# Altium schematic sheet FrontEndCircuit.SchDoc
size A3
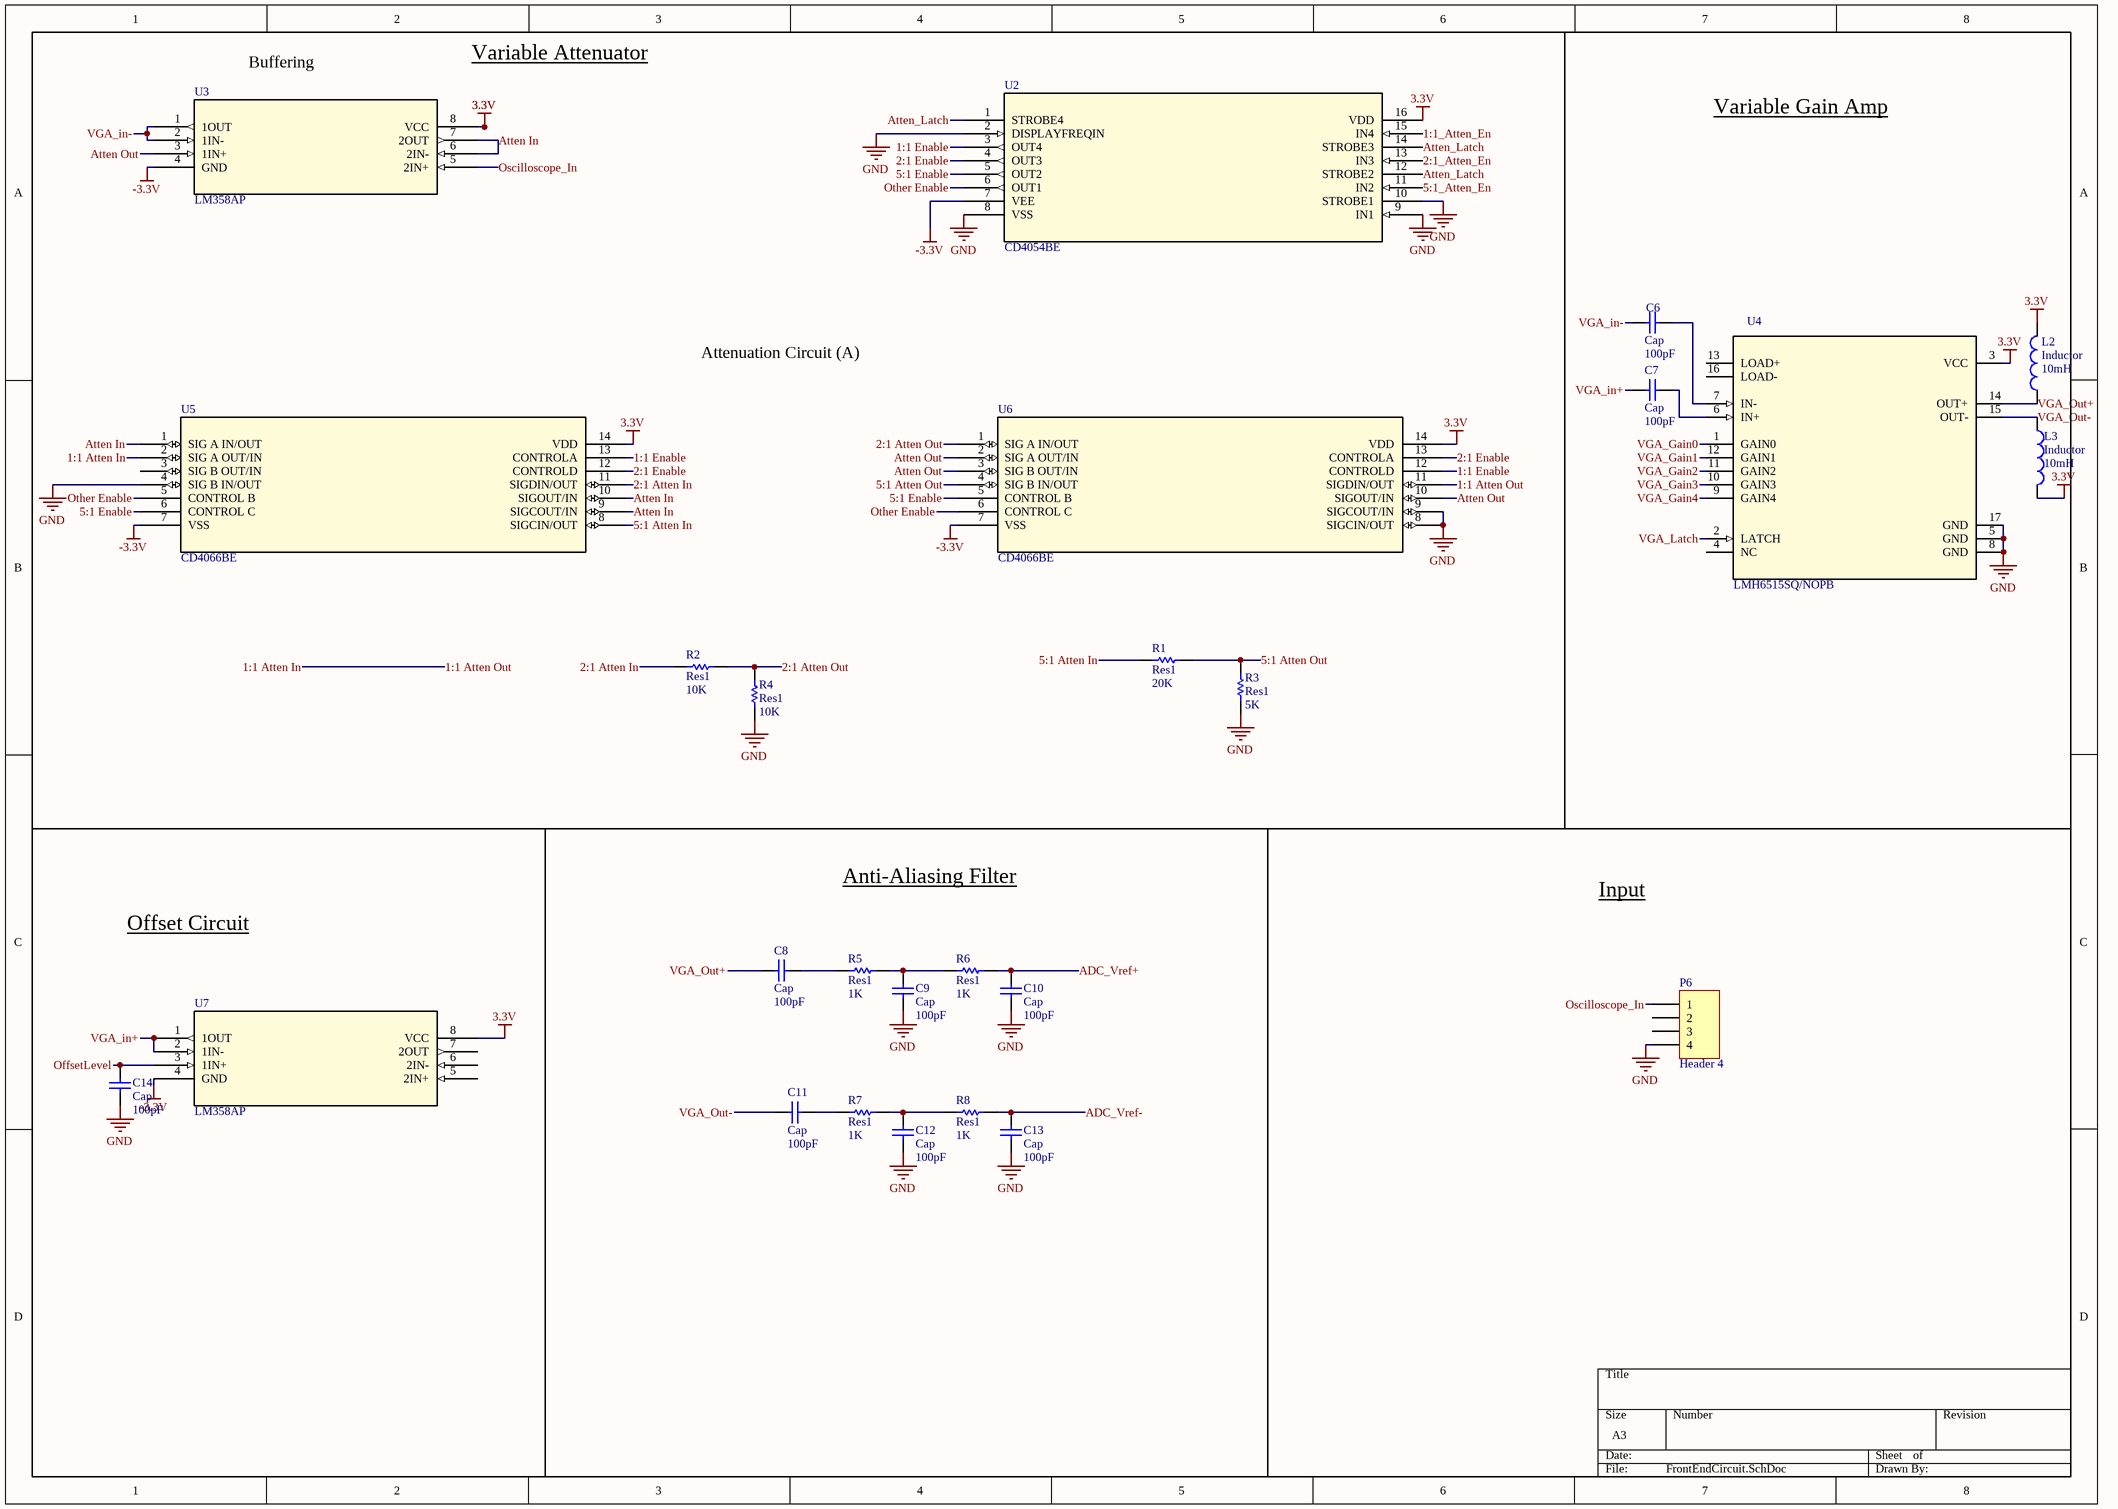
[diagram p0: FrontEndCircuit.SchDoc]

## Parts
C6  Cap  value 100pF  [6-0805_N]
C7  Cap  value 100pF  [6-0805_N]
C8  Cap  value 100pF  [6-0805_N]
C9  Cap  value 100pF  [6-0805_N]
C10  Cap  value 100pF  [6-0805_N]
C11  Cap  value 100pF  [6-0805_N]
C12  Cap  value 100pF  [6-0805_N]
C13  Cap  value 100pF  [6-0805_N]
C14  Cap  value 100pF  [6-0805_N]
L2  Inductor  value 10mH  [6-0805_N]
L3  Inductor  value 10mH  [6-0805_N]
P6  Header 4  [HDR1X4]
R1  Res1  value 20K  [AXIAL-0.3]
R2  Res1  value 10K  [AXIAL-0.3]
R3  Res1  value 5K  [AXIAL-0.3]
R4  Res1  value 10K  [AXIAL-0.3]
R5  Res1  value 1K  [AXIAL-0.3]
R6  Res1  value 1K  [AXIAL-0.3]
R7  Res1  value 1K  [AXIAL-0.3]
R8  Res1  value 1K  [AXIAL-0.3]
U2  CD4054BE  [N16]
U3  LM358AP  [P8]
U4  LMH6515SQ/NOPB  [SQA16A]
U5  CD4066BE  [N14]
U6  CD4066BE  [N14]
U7  LM358AP  [P8]

## Blocks framed on the sheet
Variable Attenuator: R1-R4 U2 U3 U5 U6
Variable Gain Amp: C6 C7 L2 L3 U4
Offset Circuit: C14 U7
Anti-Aliasing Filter: C8-C13 R5-R8
Input: P6

## Nets
3.3V: L2.2 L3.2 U2.16(VDD) U3.8(VCC) U4.3(VCC) U5.14(VDD) U6.14(VDD) U7.8(VCC)
-3.3V: U2.7(VEE) U3.4(GND) U5.7(VSS) U6.7(VSS) U7.4(GND)
GND: C9.1 C10.1 C12.1 C13.1 C14.1 P6.4 R3.1 R4.1 U2.2(DISPLAYFREQIN) U2.8(VSS) U2.9(IN1) U2.10(STROBE1) U4.5(GND) U4.8(GND) U4.17(GND) U5.4(SIG_B_IN/OUT) U6.8(SIGCIN/OUT) U6.9(SIGCOUT/IN)
1:1 Atten In: U5.2(SIG_A_OUT/IN) U6.11(SIGDIN/OUT)  [also labelled 1:1 Atten Out]
1:1 Enable: U2.3(OUT4) U5.13(CONTROLA) U6.12(CONTROLD)
1:1_Atten_En: U2.15(IN4)
2:1 Atten In: R2.1 U5.11(SIGDIN/OUT)
2:1 Atten Out: R2.2 R4.2 U6.1(SIG_A_IN/OUT)
2:1 Enable: U2.4(OUT3) U5.12(CONTROLD) U6.13(CONTROLA)
2:1_Atten_En: U2.13(IN3)
5:1 Atten In: R1.1 U5.8(SIGCIN/OUT)
5:1 Atten Out: R1.2 R3.2 U6.4(SIG_B_IN/OUT)
5:1 Enable: U2.5(OUT2) U5.6(CONTROL_C) U6.5(CONTROL_B)
5:1_Atten_En: U2.11(IN2)
ADC_Vref+: C10.2 R6.2
ADC_Vref-: C13.2 R8.2
Atten In: U3.6(2IN-) U3.7(2OUT) U5.1(SIG_A_IN/OUT) U5.9(SIGCOUT/IN) U5.10(SIGOUT/IN)
Atten Out: U3.3(1IN+) U6.2(SIG_A_OUT/IN) U6.3(SIG_B_OUT/IN) U6.10(SIGOUT/IN)
Atten_Latch: U2.1(STROBE4) U2.12(STROBE2) U2.14(STROBE3)
OffsetLevel: C14.2 U7.3(1IN+)
Oscilloscope_In: P6.1 U3.5(2IN+)
Other Enable: U2.6(OUT1) U5.5(CONTROL_B) U6.6(CONTROL_C)
VGA_Gain0: U4.1(GAIN0)
VGA_Gain1: U4.12(GAIN1)
VGA_Gain2: U4.11(GAIN2)
VGA_Gain3: U4.10(GAIN3)
VGA_Gain4: U4.9(GAIN4)
VGA_in+: C7.1 U7.1(1OUT) U7.2(1IN-)
VGA_in-: C6.1 U3.1(1OUT) U3.2(1IN-)
VGA_Latch: U4.2(LATCH)
VGA_Out+: C8.2 L2.1 U4.14(OUT+)
VGA_Out-: C11.2 L3.1 U4.15(OUT-)
NetC6_2: C6.2 U4.7(IN-)
NetC7_2: C7.2 U4.6(IN+)
NetC8_1: C8.1 R5.1
NetC9_2: C9.2 R5.2 R6.1
NetC11_1: C11.1 R7.1
NetC12_2: C12.2 R7.2 R8.1

Not connected (* = marked no-connect by the designer): P6 2 3; U4 4(NC) 13(LOAD+) 16(LOAD-); U5 3(SIG_B_OUT/IN); U7 5(2IN+) 6(2IN-) 7(2OUT)

## Notes on the sheet
- Buffering
- Attenuation Circuit (A)

## Library data of the parts
C6-C14 = Cap: Capacitor; Published: 8-Jun-2000; LatestRevisionDate: 17-Jul-2002; LatestRevisionNote: Re-released for DXP Platform.; PackageReference: RAD-0.3; Publisher: Altium Limited; PackageDescription: Radial Cap, Thru-Hole; 2 Leads; 0.3 in Pin Spacing
L2 L3 = Inductor: Code_IEC: 1005; Published: 8-Jun-2000; LatestRevisionDate: 29-May-2009; LatestRevisionNote: IPC-7351 Footprint Added.; PackageReference: 0402-A; Publisher: Altium Limited; PackageDescription: Chip Inductor; Code_JEITA: 0402
P6 = Header 4: Header, 4-Pin; LatestRevisionDate: 17-Jul-2002; LatestRevisionNote: Re-released for DXP Platform.; Publisher: Altium Limited
R1-R8 = Res1: Resistor; Published: 8-Jun-2000; LatestRevisionDate: 17-Jul-2002; LatestRevisionNote: Re-released for DXP Platform.; PackageReference: AXIAL-0.3; Publisher: Altium Limited; PackageDescription: Axial Device, Thru-Hole; 2 Leads; 0.3 in Pin Spacing
U2 = CD4054BE: CMOS 4-Segment Liquid-Crystal Display Driver; Manufacturer: Texas Instruments; INDUSTRY_STD_PKG_TYPE: PDIP; FAMILY_NAME: NON-INVERTING BUFFER/DRIVER; PIN_COUNT: 16; PACKAGE_DESIGNATOR: N; Datasheet_URL: http://www.ti.com/lit/gpn/CD4054B; GENERIC_PART_NUMBER: CD4054B; Copyright: Copyright (C) 2018 Accelerated Designs. All rights reserved; RefDes: RefDes; Type: DEV
U3 U7 = LM358AP: Dual Operational Amplifier; Manufacturer: Texas Instruments; GENERIC_PART_NUMBER: LM358A; INDUSTRY_STD_PKG_TYPE: PDIP; FAMILY_NAME: STANDARD LINEAR AMPLIFIER; PIN_COUNT: 8; PACKAGE_DESIGNATOR: P; Datasheet_URL: http://www.ti.com/lit/gpn/LM358A; Vendor: Texas Instruments; Manufacturer_Part_Number: LM358AP; Copyright: Copyright (C) 2018 Accelerated Designs. All rights reserved; RefDes: RefDes; Type: DEV
U4 = LMH6515SQ/NOPB: No Description Available; Copyright: Copyright (C) 2018 Accelerated Designs. All rights reserved; RefDes: RefDes; Type: DEV
U5 U6 = CD4066BE: CMOS Quad Bilateral Switch; Manufacturer: Texas Instruments; INDUSTRY_STD_PKG_TYPE: PDIP; FAMILY_NAME: ANALOG SWITCH/MULTIPLEXER (greater than 5V); PIN_COUNT: 14; PACKAGE_DESIGNATOR: N; Datasheet_URL: http://www.ti.com/lit/gpn/CD4066B; GENERIC_PART_NUMBER: CD4066B; Copyright: Copyright (C) 2018 Accelerated Designs. All rights reserved; RefDes: RefDes; Type: DEV